# EasyEDA Pro project b6s.eprj, board PCB2
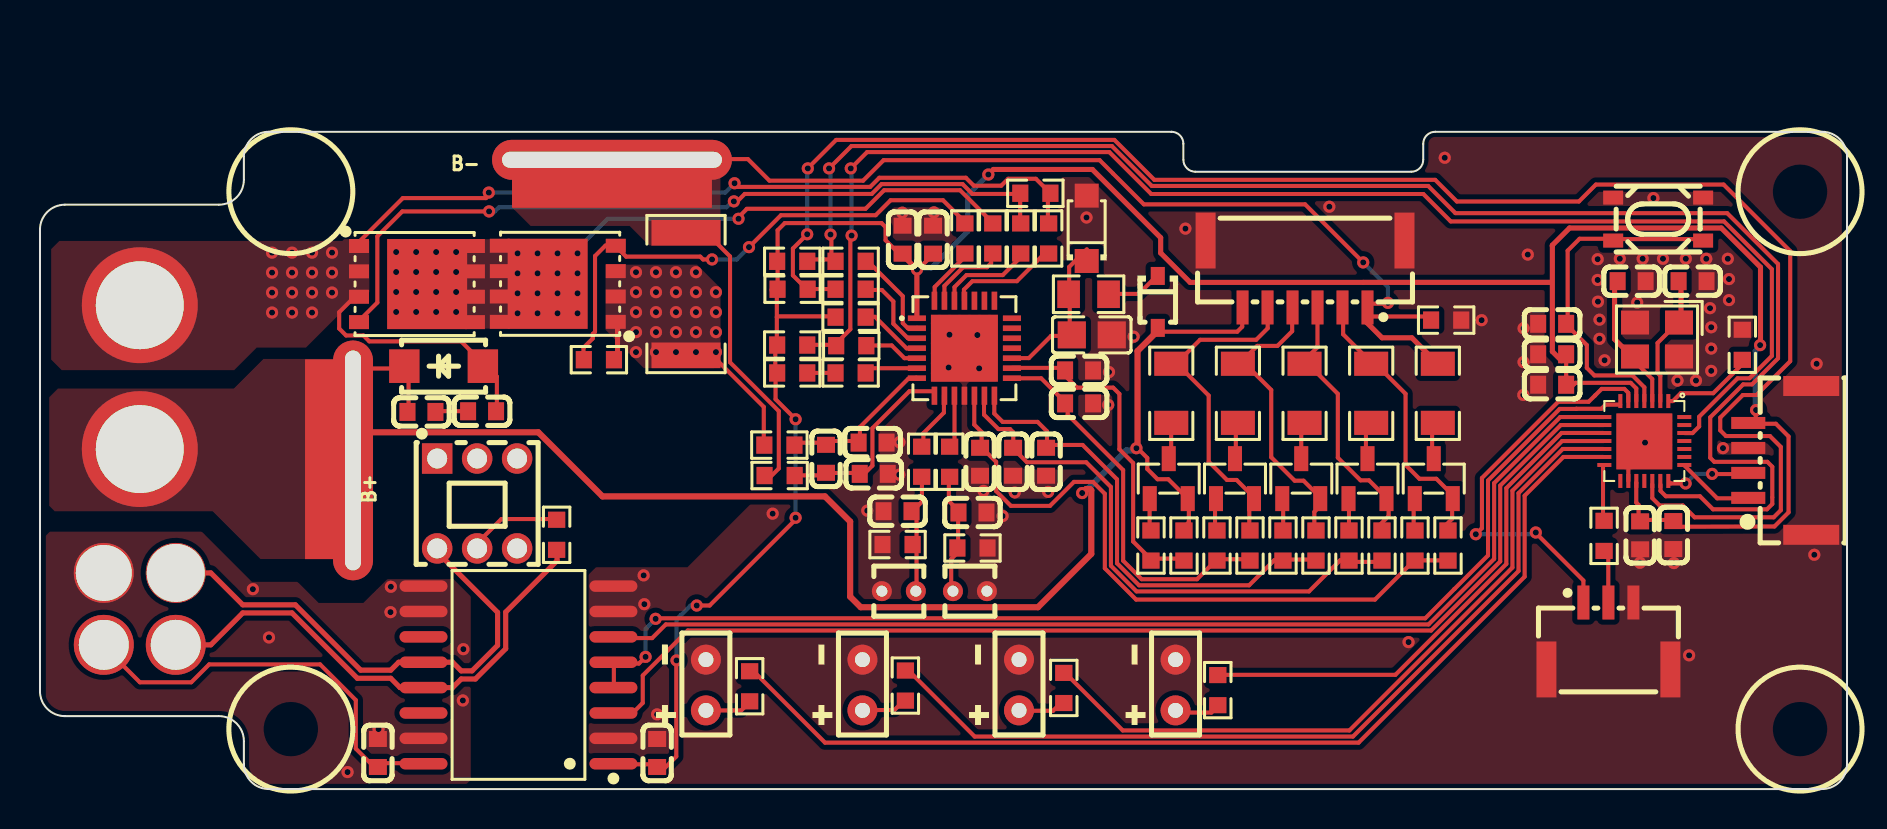
[diagram p4: board, top side]
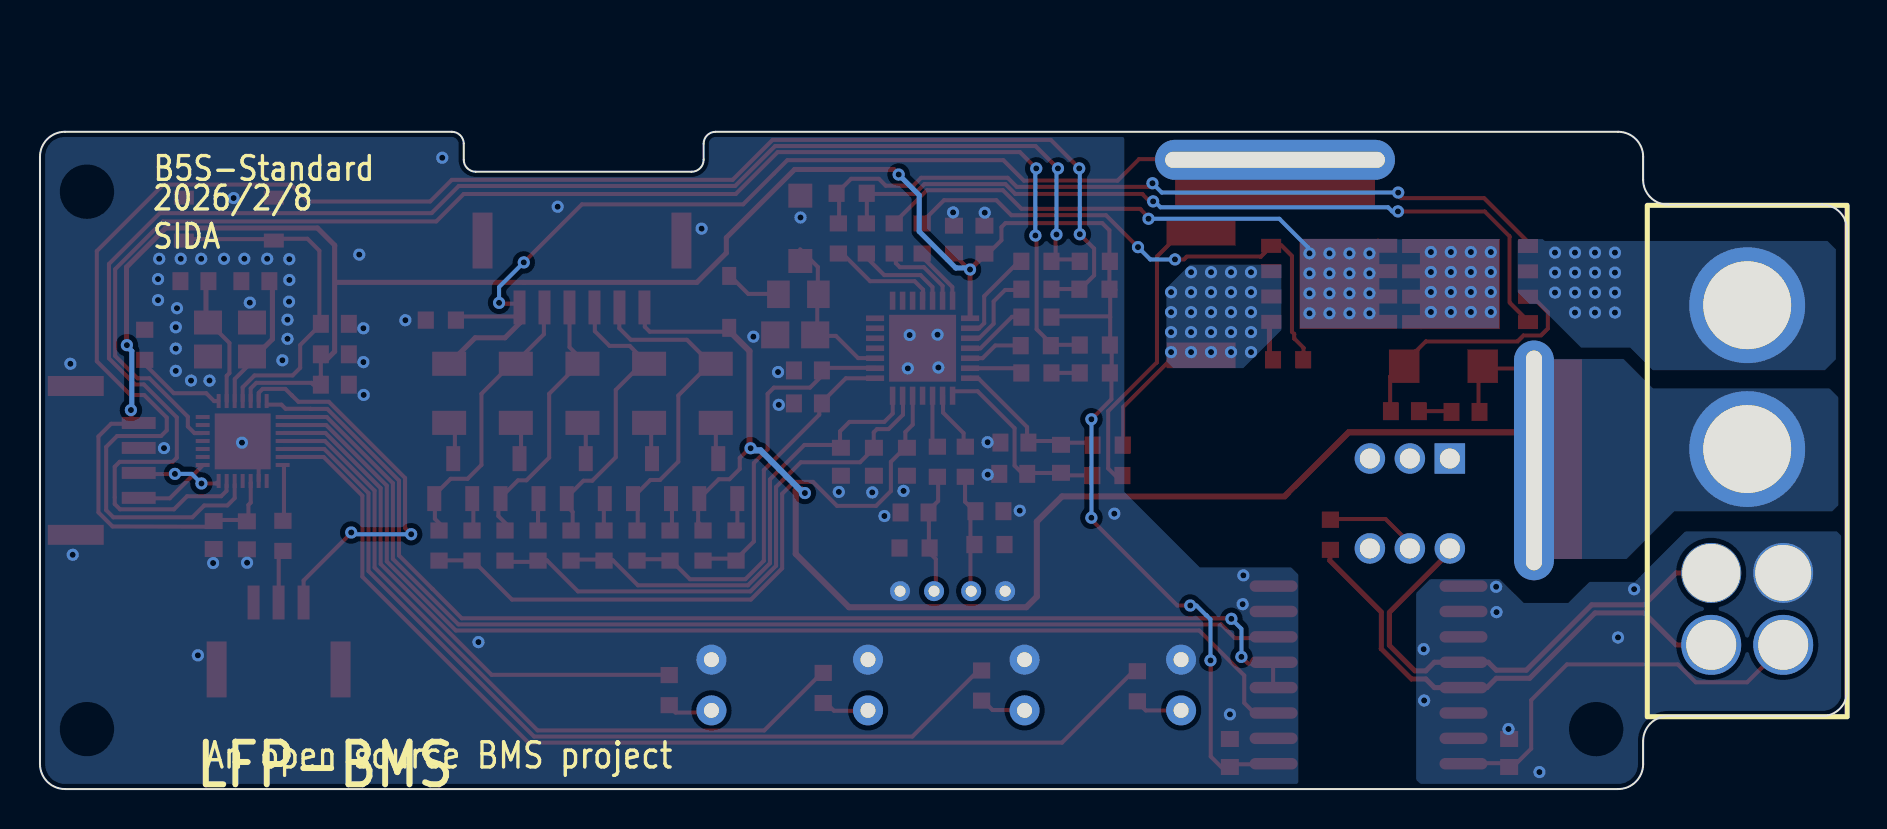
[diagram p5: board, bottom side, seen from below]

Outline 90.4 x 32.9 mm; copper layers: Top Layer, Bottom Layer. Coordinates in mm from the lower left corner of the outline.
Outline path: 0,28 0,4.9 arc(0.37,4.02) 1.25,3.65 8.95,3.65 arc(9.83,3.28) 10.2,2.4 10.2,1.25 arc(10.57,0.37) 11.45,0 89.15,0 arc(90.03,0.37) 90.4,1.25 90.4,31.65 arc(90.03,32.53) 89.15,32.9 69.8,32.9 arc(69.38,32.72) 69.2,32.3 69.2,31.5 arc(69.02,31.08) 68.6,30.9 57.8,30.9 arc(57.38,31.08) 57.2,31.5 57.2,32.3 arc(57.02,32.72) 56.6,32.9 11.45,32.9 arc(10.57,32.53) 10.2,31.65 10.2,30.5 arc(9.83,29.62) 8.95,29.25 1.25,29.25 arc(0.37,28.88) 0,28
Stack: Top Layer 0.035mm / Dielectric1 1.51mm FR4 er 4.5 / Bottom Layer 0.035mm

## Design rules (mm)
template: 自定义配置
spacing copperThickness1oz (default): track to track 0.102, other pairs 0.152 to 0.3
spacing copperThickness2oz: track to track 0.203, other pairs 0.152 to 0.3
track width copperThickness1oz (default): min 0.127, default 0.203, max 2.54
track width copperThickness2oz: min 0.203, default 0.254, max 2.54
differential pair differentialPair (default): width min 0.127, default 0.254, max 2.54; gap min 0.152, default 0.152
via viaSize (default): diameter min 0.5, default 0.61, max 10; hole min 0.3, default 0.305, max 6.299

## Placement (name value [footprint] x y rotation side)
B+  -  [Wire_14AWG]  15.66 16.45 0 top
B-  -  [Wire_14AWG]  28.61 31.5 90 top
BUTTON  WAFER-GH1.25-3PLB  [CONN-SMD_3P-P1.25_XUNPU_WAFER-GH1.25-3PLB]  78.46 7.66 0 top
C1  100nF  [C0603]  43.15 27.5 90 top
C2  10uF  [C0603]  44.68 27.5 90 top
C3  100nF  [C0603]  46.65 13.84 180 top
C4  100nF  [C0603]  42.9 13.91 0 top
C5  100nF  [C0603]  39.32 16.53 90 top
C6  100nF  [C0603]  41.65 17.34 180 top
C7  100nF  [C0603]  41.71 15.78 180 top
C8  100nF  [C0603]  48.68 16.38 90 top
C9  100nF  [C0603]  50.33 16.38 90 top
C10  100nF  [C0603]  51.98 19.3 180 top
C11  100nF  [C0603]  51.98 20.95 180 top
C13  100nF  [C0603]  47.03 16.38 90 top
C33  10uF  [C0805]  52.62 22.73 180 top
C34  100nF  [C0603]  19.08 18.88 180 top
C35  100nF  [C0603]  22.12 18.91 180 top
C36  4.7uF  [C0603]  75.65 20.24 0 top
C39  20pF  [C0603]  82.67 25.42 180 top
C40  20pF  [C0603]  79.63 25.42 180 top
C42  100nF  [C0603]  75.65 23.29 0 top
C43  100nF  [C0603]  75.65 21.76 180 top
C44  100nF  [C0603]  80.05 12.7 270 top
C45  100nF  [C0603]  30.87 1.81 270 top
C46  4.7uF  [C0603]  16.9 1.81 90 top
C47  1uF  [C0603]  81.71 12.71 270 top
D1  1N5819WS S4  [SOD-323_L1.6-W1.3-LS2.7-RD]  55.92 24.38 270 top
D2  SS14  [SMA_L4.2-W2.6-LS5.0-RD_1]  20.19 21.17 0 top
D50  SMF24A  [SOD-123FL_L2.7-W1.8-LS3.8-RD]  52.36 28.07 90 top
H10  VOUT  [AMSS_XT60_2+4]  4.99 17.02 180 bottom
LED5  XL-257UBC-L  [LED-TH_L5.0-W2.5-P2.54-FD_GREEN_XL-257SYGD-L]  56.81 5.21 90 top
LED6  XL-257UBC-L  [LED-TH_L5.0-W2.5-P2.54-FD_GREEN_XL-257SYGD-L]  48.98 5.21 90 top
LED7  XL-257UBC-L  [LED-TH_L5.0-W2.5-P2.54-FD_GREEN_XL-257SYGD-L]  41.15 5.21 90 top
LED8  XL-257UBC-L  [LED-TH_L5.0-W2.5-P2.54-FD_GREEN_XL-257SYGD-L]  33.31 5.21 90 top
NOREF  -  [Pad_e309]  28.61 29.84 90 top
NOREF#2  -  [Pad_e307]  14.01 16.51 0 top
Q6  SS8550  [SOT-23-3_L2.9-W1.3-P1.90-LS2.4-BR]  63.1 15.54 270 top
Q7  SS8550  [SOT-23-3_L2.9-W1.3-P1.90-LS2.4-BR]  66.41 15.54 270 top
Q8  SS8550  [SOT-23-3_L2.9-W1.3-P1.90-LS2.4-BR]  69.73 15.54 270 top
Q9  SS8550  [SOT-23-3_L2.9-W1.3-P1.90-LS2.4-BR]  59.78 15.54 270 top
Q10  SS8550  [SOT-23-3_L2.9-W1.3-P1.90-LS2.4-BR]  56.47 15.54 270 top
Q11  NCEP3090GU  [DFN-8_L5.8-W4.9-P1.27-LS6.1-BL-2]  18.86 25.28 270 top
Q12  NCEP3090GU  [DFN-8_L5.8-W4.9-P1.27-LS6.1-BL-2]  25.9 25.29 90 top
R2  10kΩ  [R0603]  40.55 23.62 180 top
R3  10kΩ  [R0603]  37.65 25.02 180 top
R4  10kΩ  [R0603]  37.63 26.42 180 top
R5  100Ω  [R0603]  40.55 26.42 0 top
R6  100Ω  [R0603]  40.55 25.02 0 top
R8  100Ω  [R0603]  40.58 22.19 0 top
R9  100Ω  [R0603]  40.55 20.83 0 top
R10  10kΩ  [R0603]  37.63 22.22 180 top
R11  10kΩ  [R0603]  37.63 20.83 180 top
R12  100Ω  [R0603]  44.11 16.38 90 top
R13  100Ω  [R0603]  45.51 16.38 90 top
R14  MF52A103F3950 (A1)  [RES-TH_L2.5-W2.5-P1.70-D0.3]  42.97 9.91 0 top
R15  NC  [R0603]  46.65 12.06 180 top
R16  MF52A103F3950 (A1)  [RES-TH_L2.5-W2.5-P1.70-D0.3]  46.52 9.91 180 top
R17  NC  [R0603]  42.9 12.24 0 top
R20  100Ω  [R0603]  37 15.69 0 top
R21  100Ω  [R0603]  36.99 17.22 0 top
R22  51kΩ  [R0603]  47.67 27.56 270 top
R23  1kΩ  [R0603]  49.06 27.56 270 top
R24  1kΩ  [R0603]  46.27 27.56 270 top
R25  10MΩ  [R0603]  27.96 21.49 180 top
R26  1MΩ  [R0603]  49.8 29.82 180 top
R27  1MΩ  [R0603]  50.46 27.56 270 top
R31  1kΩ  [R0603]  57.23 12.19 90 top
R32  510Ω  [R0603]  55.58 12.19 90 top
R33  1kΩ  [R0603]  60.53 12.19 90 top
R34  510Ω  [R0603]  58.88 12.19 90 top
R35  1kΩ  [R0603]  63.83 12.19 90 top
R36  510Ω  [R0603]  62.18 12.19 90 top
R37  1kΩ  [R0603]  67.14 12.19 90 top
R38  510Ω  [R0603]  65.48 12.19 90 top
R39  1kΩ  [R0603]  70.44 12.19 90 top
R40  510Ω  [R0603]  68.79 12.19 90 top
R64  150Ω  [R1206]  56.59 19.81 90 top
R65  150Ω  [R1206]  59.93 19.81 90 top
R66  150Ω  [R1206]  63.26 19.81 90 top
R67  150Ω  [R1206]  66.6 19.81 90 top
R68  150Ω  [R1206]  69.93 19.81 90 top
R76  33Ω  [R0805]  52.46 24.77 0 top
R79  470  [R0603]  43.29 5.18 90 top
R80  470  [R0603]  35.5 5.14 90 top
R81  1kΩ  [R0603]  58.92 4.95 90 top
R82  470  [R0603]  51.22 5.06 90 top
R84  5mΩ  [R2512]  32.32 24.78 90 top
R85  1kΩ  [R0603]  78.25 12.67 270 top
R86  10kΩ  [R0603]  85.16 22.24 270 top
R87  180  [R0603]  25.85 12.73 90 top
R88  0  [R0603]  70.35 23.47 0 top
SW15  HX TS3425BA 250gf  [SW-SMD_4P-L4.2-W3.2-P2.15-LS4.6-1]  80.95 28.53 180 top
SW16  5.8 ZSGT  [SW-TH_5.8ZSGT]  21.87 14.3 180 top
U4  SH367303Q/028QY  [QFN-28_L5.0-W5.0-P0.50-TL-EP3.3]  46.25 22.07 0 top
U6  WAFER-GH1.25-6PLB  [CONN-SMD_6P-P1.25_XUNPU_WAFER-GH1.25-6PLB]  63.29 25.78 180 top
U12  ISO3088DWR  [SOIC-16_L10.3-W7.5-P1.27-LS10.3-BL]  23.94 5.71 90 top
U13  GD32E230G8U6TR  [QFN-28_L4.0-W4.0-P0.40-BL-EP2.8]  80.26 17.42 180 top
U14  WAFER-GH1.25-4PWB  [CONN-SMD_4P-P1.25_XUNPU_WAFER-GH1.25-4PWB]  87.04 16.45 90 top
X2  12MHz  [CRYSTAL-SMD_4P-L3.2-W2.5-BL]  80.89 22.5 180 top

## Footprints (pads in the part's own frame, mm; a bottom-side part is the same pattern mirrored in y, then rotated)
AMSS_XT60_2+4
  round 5.8 hole 4.4: 1(0,7.2) 2(0,0)
  round 3 hole 2.9x2.5: 3(-1.8,-6.2)
  round 3 hole 2.8x2.5: 4(1.8,-6.2)
  round 3 hole 2.5: 5(-1.8,-9.8) 6(1.8,-9.8)
C0603
  rect 0.8x0.9 smd: 1(-0.7,0) 2(0.7,0)
C0805
  rect 1.41x1.35 smd: 1(-1,0) 2(1,0)
CONN-SMD_3P-P1.25_XUNPU_WAFER-GH1.25-3PLB
  rect 0.6x1.7 smd: 1(-1.25,1.675) 2(0.001,1.675) 3(1.25,1.675)
  rect 1x2.8 smd: 4(3.1,-1.675) 5(-3.1,-1.675)
CONN-SMD_4P-P1.25_XUNPU_WAFER-GH1.25-4PWB
  rect 0.6x1.7 smd: 1(-1.875,1.575) 2(-0.625,1.575) 3(0.625,1.575) 4(1.875,1.575)
  rect 1x2.8 smd: 5(3.725,-1.575) 6(-3.725,-1.575)
CONN-SMD_6P-P1.25_XUNPU_WAFER-GH1.25-6PLB
  rect 0.6x1.7 smd: 1(-3.125,1.675) 2(-1.875,1.675) 3(-0.625,1.675) 4(0.625,1.675) 5(1.875,1.675) 6(3.125,1.675)
  rect 1x2.8 smd: 7(4.975,-1.675) 8(-4.975,-1.675)
CRYSTAL-SMD_4P-L3.2-W2.5-BL
  rect 1.4x1.2 smd: 1(-1.1,-0.85) 2(1.1,-0.85) 3(1.1,0.85) 4(-1.1,0.85)
DFN-8_L5.8-W4.9-P1.27-LS6.1-BL-2
  rect 0.7x1 smd: 1(-1.905,-2.9) 2(-0.635,-2.9) 3(0.635,-2.9) 4(1.905,-2.9) 5(1.905,2.9) 6(0.635,2.9) 7(-0.635,2.9) 8(-1.905,2.9)
  rect 4.51x4 smd: 8(0,0.508)
LED-TH_L5.0-W2.5-P2.54-FD_GREEN_XL-257SYGD-L
  round 1.5 hole 0.75: 1(-1.27,0) 2(1.27,0)
Pad_e307
  rect 1.5x10 smd: 1(0,0)
Pad_e309
  rect 1.5x10 smd: 1(0,0)
QFN-28_L4.0-W4.0-P0.40-BL-EP2.8
  rect 0.2x0.7 smd: 1(-1.2,-2) 2(-0.8,-2) 3(-0.4,-2) 4(-0.001,-2) 5(0.4,-2) 6(0.8,-2) 7(1.2,-2) 15(1.2,2) 16(0.8,2) 17(0.4,2) 18(0,2) 19(-0.4,2) 20(-0.8,2) 21(-1.2,2)
  rect 0.7x0.2 smd: 8(2,-1.2) 9(2,-0.8) 10(2,-0.4) 11(1.999,0) 12(2,0.4) 13(2,0.8) 14(2,1.2) 22(-2,1.2) 23(-2,0.8) 24(-2,0.4) 25(-2,0) 26(-2,-0.4) 27(-2,-0.8) 28(-2,-1.2)
  rect 2.8x2.8 smd: 29(0.001,0.02)
QFN-28_L5.0-W5.0-P0.50-TL-EP3.3
  rect 0.905x0.28 smd: 1(-2.377,1.5) 2(-2.377,1) 3(-2.377,0.5) 4(-2.377,0) 5(-2.377,-0.5) 6(-2.377,-1) 7(-2.377,-1.5) 15(2.377,-1.5) 16(2.377,-1) 17(2.377,-0.5) 18(2.377,0) 19(2.377,0.5) 20(2.377,1) 21(2.377,1.5)
  rect 0.28x0.905 smd: 8(-1.5,-2.377) 9(-1,-2.377) 10(-0.5,-2.377) 11(0,-2.377) 12(0.5,-2.377) 13(1,-2.377) 14(1.5,-2.377) 22(1.5,2.377) 23(1,2.377) 24(0.5,2.377) 25(0,2.377) 26(-0.5,2.377) 27(-1,2.377) 28(-1.5,2.377)
  rect 3.35x3.35 smd: 29(0,0)
R0603
  rect 0.806x0.864 smd: 1(-0.753,0) 2(0.753,0)
R0805
  rect 1.133x1.377 smd: 1(-1,0) 2(1,0)
R1206
  rect 1.208x1.701 smd: 1(-1.479,0) 2(1.479,0)
R2512
  rect 1.282x3.456 smd: 1(-3.067,0) 2(3.067,0)
RES-TH_L2.5-W2.5-P1.70-D0.3
  round 1 hole 0.55: 1(-0.85,0) 2(0.85,0)
SMA_L4.2-W2.6-LS5.0-RD_1
  rect 1.52x1.68 smd: 1(-1.965,0) 2(1.965,0)
SOD-123FL_L2.7-W1.8-LS3.8-RD
  rect 1.2x1.2 smd: 1(-1.635,0) 2(1.635,0)
SOD-323_L1.6-W1.3-LS2.7-RD
  rect 0.9x0.7 smd: 1(-1.3,0) 2(1.3,0)
SOIC-16_L10.3-W7.5-P1.27-LS10.3-BL
  oval 0.574x2.401 smd: 1(-4.445,-4.75) 2(-3.175,-4.75) 3(-1.905,-4.75) 4(-0.635,-4.75) 5(0.635,-4.75) 6(1.905,-4.75) 7(3.175,-4.75) 8(4.445,-4.75) 9(4.445,4.75) 10(3.175,4.75) 11(1.905,4.75) 12(0.635,4.75) 13(-0.635,4.75) 14(-1.905,4.75) 15(-3.175,4.75) 16(-4.445,4.75)
SOT-23-3_L2.9-W1.3-P1.90-LS2.4-BR
  rect 1.25x0.7 smd: 1(1,-0.95) 2(1,0.95) 3(-1,0)
SW-SMD_4P-L4.2-W3.2-P2.15-LS4.6-1
  rect 1x0.7 smd: 1(-2.25,1.075) 2(2.25,1.075) 3(-2.25,-1.075) 4(2.25,-1.075)
SW-TH_5.8ZSGT
  rect 1.524x1.524 hole 1: 1(2,-2.25)
  round 1.524 hole 1: 2(0,-2.25) 3(-2,-2.25) 4(2,2.25) 5(0,2.25) 6(-2,2.25)
Wire_14AWG
  oval 2x12 hole 0.8x11: 1(0,0)

## Nets
As in the schematic, except:
VBAT+: B+.1 C34.2 D1.2 D2.1 H10.2 NOREF#2.1 Q10.2 R31.2 U6.6
B-: B-.1 NOREF.1 R20.1 R68.2 R84.2 R88.1 U6.1

Pads without a net: SW16 1 2 3 6; U4 18 19 20 21 22 23 24; U12 11 14; U13 15 18 23 24 25 27 28

## Via types
v1: diameter 0.61, hole 0.305, Top Layer to Bottom Layer, 169 vias

## Routing (per net, layer and track width the routed paths; a pad name or vN(x,y) marks a point on that pad's centre or on a via; arc(x,y) is an arc through that point)
GND: length 0.7
  Top Layer w0.203: U13.16 79.46,16.15 79.45,16.16
  vias: v1(30.2,10.69) v1(30.23,9.25) v1(30.87,3.74) v1(36.65,13.78) v1(41.39,13.94) v1(43,17.36) v1(42.99,15.74) v1(43.14,28.85) v1(44.72,28.86) v1(45.5,22.74) v1(45.46,21.1) v1(46.89,22.73) v1(46.98,21.06) v1(47.2,14.92) v1(48.16,13.67) v1(48.77,14.85) v1(50.44,14.87) v1(52.35,28.61) v1(53.44,19.23) v1(53.48,20.87) v1(54.71,22.64) v1(57.3,28.05) v1(64.5,29.15) v1(68.46,7.35) v1(70.28,31.6) v1(72.12,23.47) v1(74.22,23.06) v1(74.22,21.37) v1(74.21,19.73) v1(74.43,26.75) v1(77.93,26.52) v1(77.93,25.48) v1(77.94,24.4) v1(78.02,23.5) v1(78.02,22.54) v1(78.27,21.46) v1(79.03,26.54) v1(79.9,24.35) v1(80.04,11.33) v1(80.18,26.54) v1(80.3,17.34) v1(80.71,29.58) v1(81.19,26.54) v1(81.74,11.31) v1(81.92,20.45) v1(82.34,26.54) v1(82.5,6.69) v1(82.84,20.45) v1(83.36,26.54) v1(83.55,24.07) v1(83.61,23.11) v1(83.61,22.05) v1(83.61,20.93) v1(84.2,17.06) v1(84.44,26.54) v1(84.49,25.53) v1(84.49,24.47) v1(88.76,11.73) v1(88.88,21.29)
GND2:
  vias: v1(10.65,10) v1(11.46,7.59) v1(15.39,0.85) v1(16.94,3) v1(17.53,8.85) v1(17.55,10.12) v1(21.18,7) v1(21.15,4.43)
VBAT+: length 74.3
  Top Layer w0.203: 15.69,20.82 15.93,21.05 18.12,21.05 ; 54.8,17.09 54.88,17.09 55.39,16.57 55.39,16.02 55.91,15.51 56.45,15.51 57.4,14.56 ; 60.14,24.1 60.14,23.14 59.9,22.89 56.15,22.89 ; 57.22,13.1 57.47,13.35 57.47,14.43 ; 18.29,19.03 18.44,19.17 18.44,21.11
  Top Layer w0.305: v1(52.14,14.82) 52.34,15.02 52.53,15.02 52.59,14.95 52.59,11.77 49.93,9.1 41.06,9.1 40.53,9.63 40.53,13.39 39.27,14.65 28.14,14.65 24.93,17.86 15.69,17.86 15.69,15.73 ; 55.77,22.78 54.91,21.92 54.91,17.07
  Bottom Layer w0.305: 54.7,16.95 54.35,16.95 52.22,14.82
  vias: v1(54.85,17.06)
VCC2: length 20.2
  Top Layer w0.203: 19.09,1.3 17.26,1.3 16.97,1.01 ; 16.78,1.04 15.8,2.02 15.8,4.45 14.01,6.24 8.46,6.24 7.57,5.34 5,5.34 3.44,6.9
ALARM: length 69.9
  Top Layer w0.203: 38.33,22.23 39.54,22.23 ; v1(40.56,31.06) 41.38,31.88 53.49,31.88 55.59,29.79 69.2,29.79 70.58,28.41 84.25,28.41 86.64,26.02 86.64,21.68 85.52,20.56 84.93,20.56 83,18.64 83,18.15 82.67,17.82 82.29,17.82 ; 39.73,22.21 40.54,23.02 40.54,27.64 v1(40.6,27.71)
  Bottom Layer w0.203: v1(40.6,27.71) 40.6,31.02 v1(40.56,31.06)
B-: length 60.7
  Top Layer w0.203: 36.34,15.6 36.52,15.6 36.96,16.05 36.96,18.92 34.52,21.36 34.52,26.66 33.28,27.9 ; 67.33,24.31 67.36,24.34 v1(67.43,24.34) ; 34.18,31.53 35.41,31.53 36.49,30.45 41.18,30.45 42.21,31.48 53.01,31.48 53.68,30.81 ; 69.54,23.41 69.29,23.65 66.64,23.65 66.44,23.86 ; 53.68,30.81 55.22,29.27 63.29,29.27 v1(66.2,26.36) ; 67.33,24.29 66.49,24.29 66.46,24.27
  Top Layer w0.254: R68.2 68.63,22.59 67.14,22.59 66.39,23.34 66.39,23.66
  Bottom Layer w0.203: v1(67.43,24.34) 67.43,25.12 v1(66.2,26.36)
BOOT0: length 4.4
  Top Layer w0.203: 85.14,21.25 83.71,19.81 82.08,19.81 81.69,19.42 81.48,19.42
CHG: length 4.6
  Top Layer w0.203: 45.75,24.46 45.75,25.13 46.35,25.73 48.16,25.73 49.06,26.62
CHGD: length 5.6
  Top Layer w0.203: 50.55,26.67 50.12,26.67 48.87,25.42 46.64,25.42 46.22,25 46.22,24.46
DSG: length 2.7
  Top Layer w0.203: 46.2,26.59 46.2,26.58 44.76,25.13 44.76,24.45
DSGD: length 4
  Top Layer w0.203: 47.58,26.82 47.58,26.32 47.38,26.12 46.18,26.12 45.25,25.19 45.25,24.44
KEY1: length 19.8
  Top Layer w0.203: 79.46,19.4 79.46,19.83 79.26,20.03 78.12,20.03 77.8,19.7 ; 77.8,19.7 77.8,19.7 ; 77.8,19.7 77.47,19.38 75.95,19.38 72.14,15.57 72.14,13.06 v1(71.83,12.75) ; 74.93,12.72 77.21,10.44 77.21,9.35
  Bottom Layer w0.203: 74.75,12.78 74.73,12.75 71.88,12.75
  vias: v1(74.83,12.84)
LED0: length 2.8
  Top Layer w0.203: 78.23,13.4 78.19,13.43 78.19,16.18 78.2,16.19
LED1: length 52.4
  Top Layer w0.203: 35.62,5.98 39.27,2.32 65.97,2.32 74.27,10.63 74.27,14.68 76.21,16.62 78.2,16.62 78.2,16.62
LED2: length 44.4
  Top Layer w0.203: 43.47,5.92 46.76,2.63 65.68,2.63 73.97,10.91 73.97,14.81 76.18,17.02 78.23,17.02
LED3: length 36.4
  Top Layer w0.203: 78.23,17.42 76.15,17.42 73.66,14.94 73.66,11.09 65.51,2.93 54.17,2.93 51.27,5.83
LED4: length 26.4
  Top Layer w0.203: 78.2,17.82 78.2,17.83 76.12,17.83 73.36,15.06 73.36,11.27 67.81,5.72 59.09,5.72 59.08,5.73
NRST: length 16.4
  Top Layer w0.203: 78.23,27.55 77.02,27.55 76.42,26.95 76.42,23.25 76.46,23.21 ; 76.46,23.03 76.58,23.03 77.38,22.22 77.38,21.08 77.76,20.7 79.67,20.7 80.26,20.11 U13.4 ; 83.03,27.53 78.77,27.53
OSC_IN: length 5.8
  Top Layer w0.203: 81.06,19.4 81.06,20.68 80.92,20.82 80.92,22.33 ; 80.92,22.33 81.65,23.06
  Top Layer w0.254: 81.97,23.47 82.1,23.6 82.1,25.22
OSC_OUT: length 6.3
  Top Layer w0.203: 79.89,21.51 79.89,21.29 80.66,20.52 80.66,19.42
  Top Layer w0.254: 79.44,21.85 78.77,22.52 78.77,25.08 79.02,25.32
P-: length 50.2
  Top Layer w0.203: 50.42,28.39 50.42,29.5 50.51,29.59 ; 22.31,21.2 22.86,20.65 22.86,19.03 ; v1(22.45,29.86) 22.45,29.72 22.31,29.58 18.15,29.58 15.87,27.3 ; 22.11,21.37 21.07,22.41 16.48,22.41 16.18,22.7 15.31,22.7 14.97,23.05 14.97,23.87 15.74,24.64 ; v1(34.75,30.32) 34.93,30.14 41.53,30.14 41.99,30.6 46.32,30.6 46.72,30.2 48.09,30.2 48.43,30.55 49.82,30.55 50.53,29.84
  Bottom Layer w0.203: v1(34.75,30.32) 34.28,29.86 v1(22.45,29.86)
  vias: v1(11.61,26.85) v1(11.61,25.85) v1(11.61,24.85) v1(11.61,23.85) v1(12.61,26.85) v1(12.61,25.85) v1(12.61,24.85) v1(12.61,23.85) v1(13.61,26.85) v1(13.61,25.85) v1(13.61,24.85) v1(13.61,23.85) v1(14.61,26.85) v1(14.61,25.85) v1(14.61,24.85)
RESET: length 1.2
  Top Layer w0.203: 38.42,20.83 39.65,20.83
RS485_A: length 25.1
  Top Layer w0.254: H10.3 8.55,10.82 10.14,9.22 12.77,9.22 16.04,5.95 17.55,5.95 17.95,6.35 20.64,6.35 21.07,5.92 21.62,5.92 22.89,7.19 22.89,8.84 19.87,11.87 SW16.4
RS485_B: length 25.7
  Top Layer w0.254: 26.11,12.03 25.87,11.79 25.87,11.43 23.3,8.86 23.3,7.02 21.78,5.51 21.07,5.51 20.64,5.08 18.01,5.08 17.55,5.54 15.88,5.54 12.61,8.81 10.14,8.81 8.55,7.22 H10.5
RS485_DE: length 59.7
  Top Layer w0.203: 28.71,6.34 28.71,5.16 28.66,5.11 ; 70.76,10.02 72.44,11.69 72.44,15.44 76.03,19.03 76.85,19.03 76.86,19.03 78.11,19.03 78.32,19.24 79.05,19.24 ; 70.76,10.02 69.3,8.55 30.82,8.55 v1(30.8,8.52) ; 70.76,10.02 70.76,10.01 ; v1(30.3,6.62) 29.96,6.28 29.04,6.28
  Bottom Layer w0.203: v1(30.3,6.62) 30.3,8.02 v1(30.8,8.52)
RX0: length 57.7
  Top Layer w0.203: 78.26,18.22 76.08,18.22 73.05,15.19 73.05,11.39 69.59,7.94 32.41,7.94 30.15,5.68 30.15,4.31 29.56,3.71
SCL: length 85.5
  Top Layer w0.203: 70.88,29.41 69.8,30.49 55.75,30.49 53.75,32.49 39.83,32.49 38.46,31.12 ; 87.56,21.41 85.87,19.72 85.19,19.72 84.06,18.59 84.06,17.95 84.34,17.67 86.54,17.67 87.09,17.12 87.09,13.96 86.73,13.6 82.78,13.6 82.18,14.19 81.02,14.19 80.66,14.56 80.66,15.24 ; v1(38.38,27.77) 37.67,27.06 37.67,25.71 38.36,25.02 ; 39.73,25.03 38.54,25.03 ; 70.88,29.41 76.99,29.41 77.83,30.26 84.23,30.26 87.56,26.93 87.56,21.42
  Bottom Layer w0.203: v1(38.38,27.77) 38.38,31.03 v1(38.41,31.07)
SDA: length 79.2
  Top Layer w0.203: 38.31,26.51 39.58,26.51 ; v1(39.47,31.07) 40.6,32.19 53.62,32.19 55.62,30.19 69.45,30.19 70.8,28.83 ; 86.66,14.6 86.66,16.13 86.42,16.38 83.76,16.38 83.56,16.58 83.56,18.61 85.21,20.25 85.65,20.25 86.95,21.56 86.95,26.28 84.4,28.83 70.81,28.83 ; 86.66,14.6 86.66,14.27 86.4,14 83.7,14 83.04,14.66 81.34,14.66 81.07,14.92 81.07,15.23 ; 39.59,26.48 39.59,27.71 v1(39.55,27.76)
  Bottom Layer w0.203: v1(39.55,27.76) 39.55,30.99 v1(39.47,31.07)
SH_+3.3V: length 130.5
  Top Layer w0.203: 39.77,23.66 36.9,23.66 36.86,23.62 ; 81.72,13.47 80.12,13.47 ; 81.72,13.47 81.77,13.47 ; 81.72,13.47 82.06,13.13 86.77,13.14 87.48,13.85 87.48,17.65 86.84,18.28 85.84,18.28 ; 36.9,26.39 36.9,24.91 36.8,24.81 ; 36.79,24.8 36.59,24.99 ; 76.42,19.94 76.82,20.33 79.58,20.33 79.86,20.05 79.86,19.42 ; 76.74,20.27 76.35,20.66 76.35,21.38 ; 30.99,1.24 29.47,1.24 29.45,1.26 ; 36.79,20.81 36.79,22.22 ; 85.83,18.35 85.83,18.87 ; v1(32.86,9.19) 33.5,9.19 37.8,13.49 ; 36.8,20.56 36.8,19.51 v1(37.8,18.51) ; 36.86,23.62 36.86,22.33 ; 36.86,23.62 36.86,24.72 ; v1(37.8,13.58) 37.76,13.54 ; 43.21,26.82 42.96,26.82 42.3,27.47 42.3,28.13 42.1,28.33 37.26,28.33 36.9,27.97 36.9,26.59 ; 79.97,13.43 79.97,14.22 79.86,14.34 79.86,15.33 79.86,15.33 ; 31.26,1.06 31.83,1.63 31.83,6.43 v1(31.84,6.44) ; 43.87,25.96 44.66,26.74
  Top Layer w0.254: 66.2,25.36 57.54,25.36 56.06,26.83 56.06,27.6 52.65,31.01 47.7,31.01 v1(47.44,30.76) ; 66.21,25.36 75.6,25.36 75.62,25.35 ; U4.1 43.87,25.96 ; v1(86.05,22.22) 86.07,22.24 86.07,26.12 84.11,28.08 76.52,28.08 75.66,27.22 75.66,27.18 ; 76.12,21.44 75.66,21.9 75.66,27.18 ; 75.66,27.18 75.66,27.18 ; 43.87,26.01 43.26,26.62
  Bottom Layer w0.203: v1(31.84,6.44) 31.84,8.5 32.05,8.7 32.06,8.7 32.55,9.19 v1(32.86,9.19) ; v1(37.8,18.51) v1(37.8,13.58)
  Bottom Layer w0.254: v1(47.44,30.76) 46.41,29.73 46.41,27.91 44.59,26.08 43.87,26.08 ; 86.02,22.13 85.8,21.92 85.8,18.99
  vias: v1(43.87,26.01) v1(85.85,18.97)
SWCLK: length 3.8
  Top Layer w0.203: 85.36,14.55 83.91,14.55 82.28,16.18
SWDIO: length 4.2
  Top Layer w0.203: 81.54,15.34 81.58,15.3 v1(82.32,15.3) ; 85.47,15.77 83.66,15.77 v1(83.65,15.78)
  Bottom Layer w0.203: v1(83.65,15.78) 82.8,15.78 v1(82.32,15.3)
TX0: length 56
  Top Layer w0.203: 29.13,7.63 29.13,7.58 29.16,7.56 30.62,7.56 31.31,8.24 69.47,8.24 72.75,11.52 72.75,15.32 76.05,18.62 78.25,18.62
$1N5331: length 11.9
  Top Layer w0.203: 63.91,23.57 63.91,22.11 63.34,21.54 ; 63.75,20.96 64.93,19.78 64.93,16.59 66.06,15.45 66.49,15.45 67.37,14.57 ; 67.47,14.43 67.47,13.66 66.99,13.18
$1N5332: length 12.2
  Top Layer w0.203: 70.36,13.24 70.64,13.53 70.64,14.34 ; 70.64,14.74 69.86,15.53 69.01,15.53 68.32,16.22 68.32,19.78 67.02,21.08 ; 65.19,23.59 65.19,22.76 66.48,21.48
$1N5333: length 13.8
  Top Layer w0.203: 60.1,21.26 60.1,21.39 60.9,22.18 61.91,22.18 62.64,22.92 62.64,23.89 ; 64.12,14.24 63.75,13.87 63.75,13.16 ; 63.98,14.66 63.21,15.43 62.77,15.43 61.6,16.61 61.6,19.98 60.34,21.23
$1N5334: length 15.4
  Top Layer w0.203: 56.92,21.25 58.47,19.7 58.47,16.39 59.38,15.47 59.86,15.47 60.63,14.7 ; 60.75,14.24 60.5,13.99 60.5,13.14 ; 57.11,21.56 58.04,22.49 60.84,22.49 61.42,23.06 61.42,23.92
$1N5338: length 1.7
  Top Layer w0.203: 69.64,16.61 69.64,17.92 69.91,18.19
$1N5339: length 1
  Top Layer w0.203: 62.19,13.18 62.19,14.16 62.15,14.2
$1N5340: length 1.5
  Top Layer w0.203: 63.1,16.74 63.1,17.76 63.41,18.07
$1N5341: length 1.6
  Top Layer w0.203: 66.6,18.13 66.33,17.86 66.33,16.65
$1N5342: length 2.7
  Top Layer w0.203: 53.48,24.78 54.97,24.78 55.83,25.64
$1N5343: length 7.6
  Top Layer w0.203: 51.49,24.79 51.49,26.13 52.37,27.02 ; 51.34,22.68 50.58,22.68 49.47,21.57 48.65,21.57 ; 51.51,22.72 51.51,24.57 51.5,24.59
$1N5344: length 1.4
  Top Layer w0.203: 65.48,14.41 65.48,13.16 65.58,13.06
$1N5345: length 23.8
  Top Layer w0.203: 50.38,17.28 50.38,17.91 49.91,18.38 48.16,18.38 47.74,18.8 47.74,19.67 ; 63.74,11.49 62.18,11.49 ; 62.1,11.45 61.74,11.45 60.49,10.2 54.98,10.2 53.88,11.3 53.88,15.5 52.16,17.22 50.39,17.22 50.34,17.28 ; 62.1,11.45 62.08,11.43 ; 62.1,11.45 62.18,11.45
$1N5346: length 27.4
  Top Layer w0.203: 65.59,11.37 66.91,11.37 67.01,11.47 ; 48.69,17.2 48.69,17.86 48.53,18.02 47.95,18.02 47.23,18.74 47.23,19.68 ; 48.8,16.93 49.37,16.36 52.34,16.36 53.58,15.12 53.58,11.17 54.86,9.89 63.49,9.89 65.04,11.45 65.47,11.45
$1N5347: length 1.3
  Top Layer w0.203: 68.72,14.37 68.72,13.08 68.7,13.06
$1N5348: length 33.9
  Top Layer w0.203: 47.1,17.11 47.83,16.38 47.83,14.91 48.57,14.17 50.53,14.17 51.73,15.38 52.68,15.38 53.27,14.78 53.27,11.05 54.83,9.48 66.79,9.48 68.64,11.34 68.68,11.34 ; 46.74,19.71 46.74,18.24 47.11,17.87 47.11,17.11 ; 68.78,11.45 70.42,11.45
$1N5350: length 1.7
  Top Layer w0.203: 56.36,16.44 56.59,16.67 56.59,18.07
$1N5351: length 1.5
  Top Layer w0.203: 59.82,16.72 59.82,17.88 60.09,18.15
$1N5352: length 1.1
  Top Layer w0.203: 58.78,13.08 58.78,14.22
$1N5355: length 19.2
  Top Layer w0.203: 60.52,11.48 60.49,11.5 58.79,11.5 ; 58.83,11.45 57.88,10.5 55.11,10.5 54.19,11.43 54.19,15.97 51.41,18.74 51.41,19.25 ; 51.21,19.44 50.09,20.56 48.61,20.56
$1N5356: length 16.2
  Top Layer w0.203: 48.61,21.08 51.09,21.08 51.15,21.02 ; 57.17,11.53 55.59,11.53 ; 51.24,20.73 51.88,20.09 53.69,20.09 54,19.78 54,17.01 54.69,16.32 54.69,12.39 55.59,11.49
$1N5358: length 1.3
  Top Layer w0.203: 55.61,14.39 55.51,14.3 55.51,13.1
$1N5363: length 22.8
  Top Layer w0.203: 35.35,29.05 41.3,29.05 42.23,29.97 46.03,29.97 47.66,28.34 ; 35.35,29.03 34.95,28.62 v1(34.95,28.55)
  Bottom Layer w0.203: v1(34.95,28.55) 28.4,28.55 26.96,27.1 26.96,26.86
  vias: v1(17.82,26.88) v1(17.82,25.88) v1(17.82,24.88) v1(17.82,23.88) v1(18.82,26.88) v1(18.82,25.88) v1(18.82,24.88) v1(18.82,23.88) v1(19.82,26.88) v1(19.82,25.88) v1(19.82,24.88) v1(19.82,23.88) v1(20.82,26.88) v1(20.82,25.88) v1(20.82,24.88) v1(20.82,23.88) v1(23.89,26.81) v1(23.89,25.81) v1(23.89,24.81) v1(23.89,23.81) v1(24.89,26.81) v1(24.89,25.81) v1(24.89,24.81) v1(24.89,23.81) v1(25.89,26.81) v1(25.89,25.81) v1(25.89,24.81) v1(25.89,23.81) v1(26.89,26.81) v1(26.89,25.81) v1(26.89,24.81) v1(26.89,23.81)
$1N5388: length 39.5
  Top Layer w0.203: 34.73,29.27 35.26,29.79 41.61,29.79 42.1,30.28 46.15,30.28 46.65,29.79 49.01,29.79 ; 48.96,28.31 49.04,28.39 49.04,29.72 ; 15.87,23.43 15.95,23.43 16.88,24.35 16.88,27.66 18.13,28.91 v1(22.47,28.91)
  Bottom Layer w0.203: 34.64,29.41 34.34,29.12 22.96,29.12 22.75,28.91 v1(22.47,28.91)
  vias: v1(34.71,29.42)
$1N5396: length 3.1
  Top Layer w0.203: 43.86,22.07 43.86,22.06 43.35,22.06 41.78,23.64 41.38,23.64
$1N5444: length 7.8
  Top Layer w0.203: 32.99,21.4 33.94,21.4 36.21,19.13 36.21,17.36
  Top Layer w0.254: 28.89,23.31 28.89,21.67 R25.1
  vias: v1(29.82,25.87) v1(29.82,24.87) v1(29.82,23.87) v1(29.82,22.87) v1(29.82,21.87) v1(30.82,25.87) v1(30.82,24.87) v1(30.82,23.87) v1(30.82,22.87) v1(30.82,21.87) v1(31.82,25.87) v1(31.82,24.87) v1(31.82,23.87) v1(31.82,22.87) v1(31.82,21.87) v1(32.82,25.87) v1(32.82,24.87) v1(32.82,23.87) v1(32.82,22.87) v1(32.82,21.87) v1(33.82,24.87) v1(33.82,23.87) v1(33.82,22.87) v1(33.82,21.87)
$1N5445: length 5.7
  Top Layer w0.203: 44.12,15.57 44.12,14.38 43.74,13.99 ; 43.85,10.01 43.85,13.76 43.74,13.88
$1N5447: length 2.4
  Top Layer w0.203: 45.75,19.64 45.75,17.45 45.61,17.31
$1N5448: length 2.9
  Top Layer w0.203: 45.22,19.69 45.22,18.84 44.19,17.81 44.19,17.26 44.18,17.24
$1N5450: length 7.8
  Top Layer w0.203: 39.21,17.23 39.2,17.24 ; 39.2,17.24 39.11,17.34 37.72,17.34 ; 39.2,17.24 39.38,17.42 40.95,17.42 ; 43.84,20.59 43.79,20.54 43.44,20.54 41.02,18.12 41.02,17.52
$1N5451: length 9.8
  Top Layer w0.203: 44.74,19.67 44.74,19.87 44.7,19.91 43.49,19.91 41.64,18.06 41.64,16.19 41.13,15.67 ; 41.06,15.68 40.92,15.82 39.32,15.82 ; 39.31,15.83 39.32,15.83 ; 37.84,15.7 39.19,15.7
$1N5452: length 25.7
  Top Layer w0.203: 46.22,28.42 45.17,29.47 42.56,29.47 41.8,28.72 37.07,28.72 v1(35.47,27.13) ; v1(33.62,26.51) 33.17,26.51 33.03,26.65 29.32,26.65 28.85,27.13 ; 28.69,27.03 28.52,27.2 28.29,27.2 27.77,26.68 27.77,22.89 27.65,22.78 27.65,22.55 27.19,22.09 27.19,21.69
  Bottom Layer w0.203: v1(33.62,26.51) 34.85,26.51 v1(35.47,27.13)
$1N5456: length 4
  Top Layer w0.203: 43.87,22.56 43.42,22.56 42.69,23.29 42.69,24.41 42.12,24.98 41.53,24.98 41.52,24.97
$1N5457: length 2.9
  Top Layer w0.203: 41.23,22.2 42.61,22.2 43.24,21.57 43.86,21.57
$1N5458: length 2.7
  Top Layer w0.203: 43.88,21.06 41.57,21.06 41.28,20.78
$1N5459: length 4.4
  Top Layer w0.203: 43.88,23.08 43.86,23.06 43.42,23.06 43.16,23.32 43.16,24.67 41.57,26.27
$1N5466: length 5.6
  Top Layer w0.203: 45.47,15.53 45.47,14.42 45.91,13.97 ; 45.95,11.88 45.58,11.51 45.58,9.95 ; 45.93,12.11 45.93,13.86
$1N5477: length 1.7
  Top Layer w0.203: 19.71,18.86 19.77,18.92 21.38,18.92
$1N29511: length 2.1
  Top Layer w0.203: 56.89,3.83 58.6,3.83 58.86,4.08
$1N29512: length 2
  Top Layer w0.203: 49.06,3.92 50.68,3.92 50.96,4.2
$1N29517: length 2
  Top Layer w0.203: 43.08,4.29 42.75,3.96 41.19,3.96
$1N29518: length 2.3
  Top Layer w0.203: 35.44,4.29 35.08,3.93 33.3,3.93
$1N33094: length 2.5
  Top Layer w0.203: 78.4,11.83 78.46,11.77 78.46,9.35
$1N36982: length 4.4
  Top Layer w0.203: 25.8,13.51 23.08,13.51 21.9,12.33

## Copper pours and planes (outline as drawn; the poured copper is in the pictures)
GND on Top Layer: 27.45,10.74 27.81,11.1 32.39,11.1 36.15,14.86 36.15,33.18 36.41,33.44 90.77,33.44 91.83,32.38 91.83,-0.6 90.74,-1.69 27.77,-1.69 27.45,-1.37
GND on Bottom Layer: 27.45,10.74 27.81,11.1 32.39,11.1 36.15,14.86 36.15,33.18 36.41,33.44 90.77,33.44 91.83,32.38 91.83,-0.6 90.74,-1.69 27.77,-1.69 27.45,-1.37
GND2 on Top Layer: 0.49,12.89 8.09,12.89 10.6,10.37 12.88,10.37 13.94,9.31 16.18,9.31 17.37,10.51 20.86,10.51 21.55,9.81 21.55,0.46 20.39,-0.7 2.03,-0.7 0.29,1.04 0.29,12.69
GND2 on Bottom Layer: 0.51,12.9 8.09,12.9 10.61,10.37 12.88,10.37 13.94,9.31 16.18,9.31 17.37,10.51 20.86,10.51 21.55,9.81 21.55,0.46 20.39,-0.7 2.03,-0.7 0.29,1.04 0.29,12.68
VBAT+ on Top Layer: 0.46,21.53 14.95,21.53 14.95,11.52 0.46,11.52
VBAT+ on Bottom Layer: 0.44,21.53 14.95,21.53 14.95,11.52 0.44,11.52
B- on Top Layer: 23.62,31.01 34.04,31.01 34.04,27.21 23.62,27.21
P- on Top Layer: 0.56,27.53 16.48,27.53 16.48,20.97 0.56,20.97
P- on Bottom Layer: 0.56,27.53 16.48,27.53 16.48,20.97 0.56,20.97
$1N5363 on Top Layer: 17.38,27.52 27.37,27.52 27.37,23.05 17.38,23.05
$1N5363 on Bottom Layer: 17.38,27.52 27.37,27.52 27.37,23.05 17.38,23.05
$1N5444 on Top Layer: 28.29,26.25 34.05,26.25 34.05,21.07 28.29,21.07
$1N5444 on Bottom Layer: 28.29,26.25 34.05,26.25 34.05,21.07 28.29,21.07

## Text on the board
Bottom Silkscreen Layer: B5S-Standard | 2026/2/8 / SIDA | An open source BMS project | LFP-BMS
